# EAGLE schematic Music Visualizer Schematic (EAGLE 7.7.0)
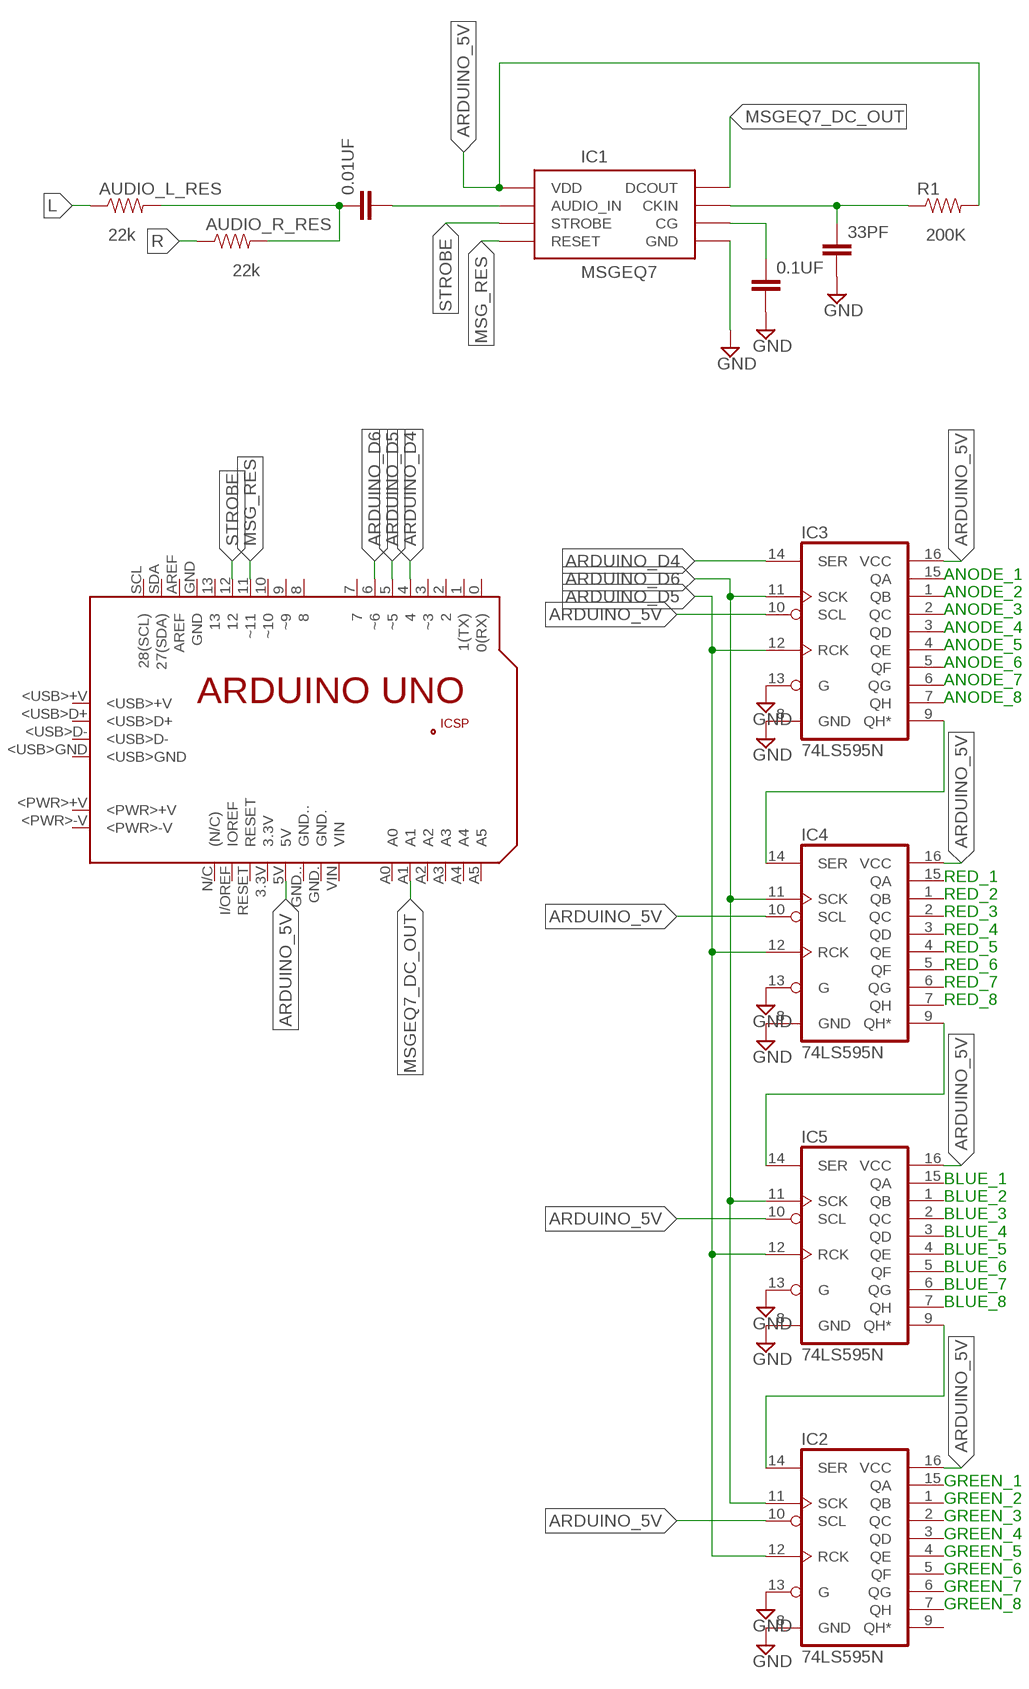
[diagram p0: schematic, sheet 1]

## Parts
0.1UF  CAPKIT  [CAP-PTH-SMALL-KIT]
0.01UF  CAPKIT  [CAP-PTH-SMALL-KIT]
33PF  CAPKIT  [CAP-PTH-SMALL-KIT]
AUDIO_L_RES  RESISTORPTH-1/4W  [AXIAL-0.4]
AUDIO_R_RES  RESISTORPTH-1/4W  [AXIAL-0.4]
IC1  MSGEQ7DIP  [DIL08]
IC2  74LS595N  [DIL16]
IC3  74LS595N  [DIL16]
IC4  74LS595N  [DIL16]
IC5  74LS595N  [DIL16]
PCB1  ARDUINO_UNO  [ARDUINO_UNO]
R1  RESISTORPTH-1/4W  [AXIAL-0.4]

## Nets
ARDUINO_5V: IC1.1(VDD) IC2.10(SCL) IC2.16(VCC) IC3.10(SCL) IC3.16(VCC) IC4.10(SCL) IC4.16(VCC) IC5.10(SCL) IC5.16(VCC) PCB1.5V R1.P$2
ARDUINO_D4: IC3.14(SER) PCB1.4
ARDUINO_D5: IC2.12(RCK) IC3.12(RCK) IC4.12(RCK) IC5.12(RCK) PCB1.5(~5)
ARDUINO_D6: IC2.11(SCK) IC3.11(SCK) IC4.11(SCK) IC5.11(SCK) PCB1.6(~6)
GND: 0.1UF.2 33PF.2 IC1.2(GND) IC2.8(GND) IC2.13(G) IC3.8(GND) IC3.13(G) IC4.8(GND) IC4.13(G) IC5.8(GND) IC5.13(G)
L: AUDIO_L_RES.P$1
MSG_RES: IC1.7(RESET) PCB1.11(~11)
MSGEQ7_DC_OUT: IC1.3(DCOUT) PCB1.A1
N$3: 0.1UF.1 IC1.6(CG)
N$4: 33PF.1 IC1.8(CKIN) R1.P$1
N$5: 0.01UF.2 IC1.5(AUDIO_IN)
N$6: 0.01UF.1 AUDIO_L_RES.P$2 AUDIO_R_RES.P$2
N$8: IC3.9(QH*) IC4.14(SER)
N$9: IC4.9(QH*) IC5.14(SER)
N$10: IC2.14(SER) IC5.9(QH*)
R: AUDIO_R_RES.P$1
STROBE: IC1.4(STROBE) PCB1.12
Unconnected: IC2.1(QB) IC2.2(QC) IC2.3(QD) IC2.4(QE) IC2.5(QF) IC2.6(QG) IC2.7(QH) IC2.9(QH*) IC2.15(QA) IC3.1(QB) IC3.2(QC) IC3.3(QD) IC3.4(QE) IC3.5(QF) IC3.6(QG) IC3.7(QH) IC3.15(QA) IC4.1(QB) IC4.2(QC) IC4.3(QD) IC4.4(QE) IC4.5(QF) IC4.6(QG) IC4.7(QH) IC4.15(QA) IC5.1(QB) IC5.2(QC) IC5.3(QD) IC5.4(QE) IC5.5(QF) IC5.6(QG) IC5.7(QH) IC5.15(QA) PCB1.0(0(RX)) PCB1.1(1(TX)) PCB1.2 PCB1.3(~3) PCB1.3.3V PCB1.7 PCB1.8 PCB1.9(~9) PCB1.10(~10) PCB1.13 PCB1.+5V PCB1.<PWR>+V PCB1.<PWR>-V PCB1.<USB>+V PCB1.<USB>D+ PCB1.<USB>D- PCB1.<USB>GND PCB1.A0 PCB1.A2 PCB1.A3 PCB1.A4 PCB1.A5 PCB1.AREF PCB1.GND PCB1.GND. PCB1.GND.. PCB1.GND_ PCB1.I/OREF(IOREF) PCB1.MISO PCB1.MOSI PCB1.N/C((N/C)) PCB1.RESET PCB1.RESET. PCB1.SCK PCB1.SCL(28(SCL)) PCB1.SDA(27(SDA)) PCB1.VIN

## Notes on the sheet
- ANODE_1
  ANODE_2
  ANODE_3
  ANODE_4
  ANODE_5
  ANODE_6
  ANODE_7
  ANODE_8
- RED_1
  RED_2
  RED_3
  RED_4
  RED_5
  RED_6
  RED_7
  RED_8
- BLUE_1
  BLUE_2
  BLUE_3
  BLUE_4
  BLUE_5
  BLUE_6
  BLUE_7
  BLUE_8
- GREEN_1
  GREEN_2
  GREEN_3
  GREEN_4
  GREEN_5
  GREEN_6
  GREEN_7
  GREEN_8

## Library data of the parts
0.1UF 0.01UF 33PF = Capacitors FromSparkFun:CAP: Capacitor Standard 0603 ceramic capacitor, and 0.1" leaded capacitor.
AUDIO_L_RES AUDIO_R_RES = ResistorsFromSparkFun:RESISTOR: Resistor Basic schematic elements and footprints for 0603, 1206, and PTH resistors.; RESISTANCE: 22k
IC1 = MSGEQ7:MSGEQ7: 7-band graphic equalizer
IC2-IC5 = SparkFun-DigitalIC:74*595: 8-bit SHIFT REGISTER, output latch
PCB1 = E14_Arduino_revC:ARDUINO_UNO: Device for representing an Arduino Uno board with a footprint in an EAGLE design. Created by Dave Young for Element14. More EAGLE documentation at: http://www.element14.com/community/community/knode/cadsoft_eagle
R1 = ResistorsFromSparkFun:RESISTOR: Resistor Basic schematic elements and footprints for 0603, 1206, and PTH resistors.; R: 200K